# Altium schematic sheet Arduino MEGA 2560.SchDoc
size A; SheetNumber: 1; SheetTotal: 1
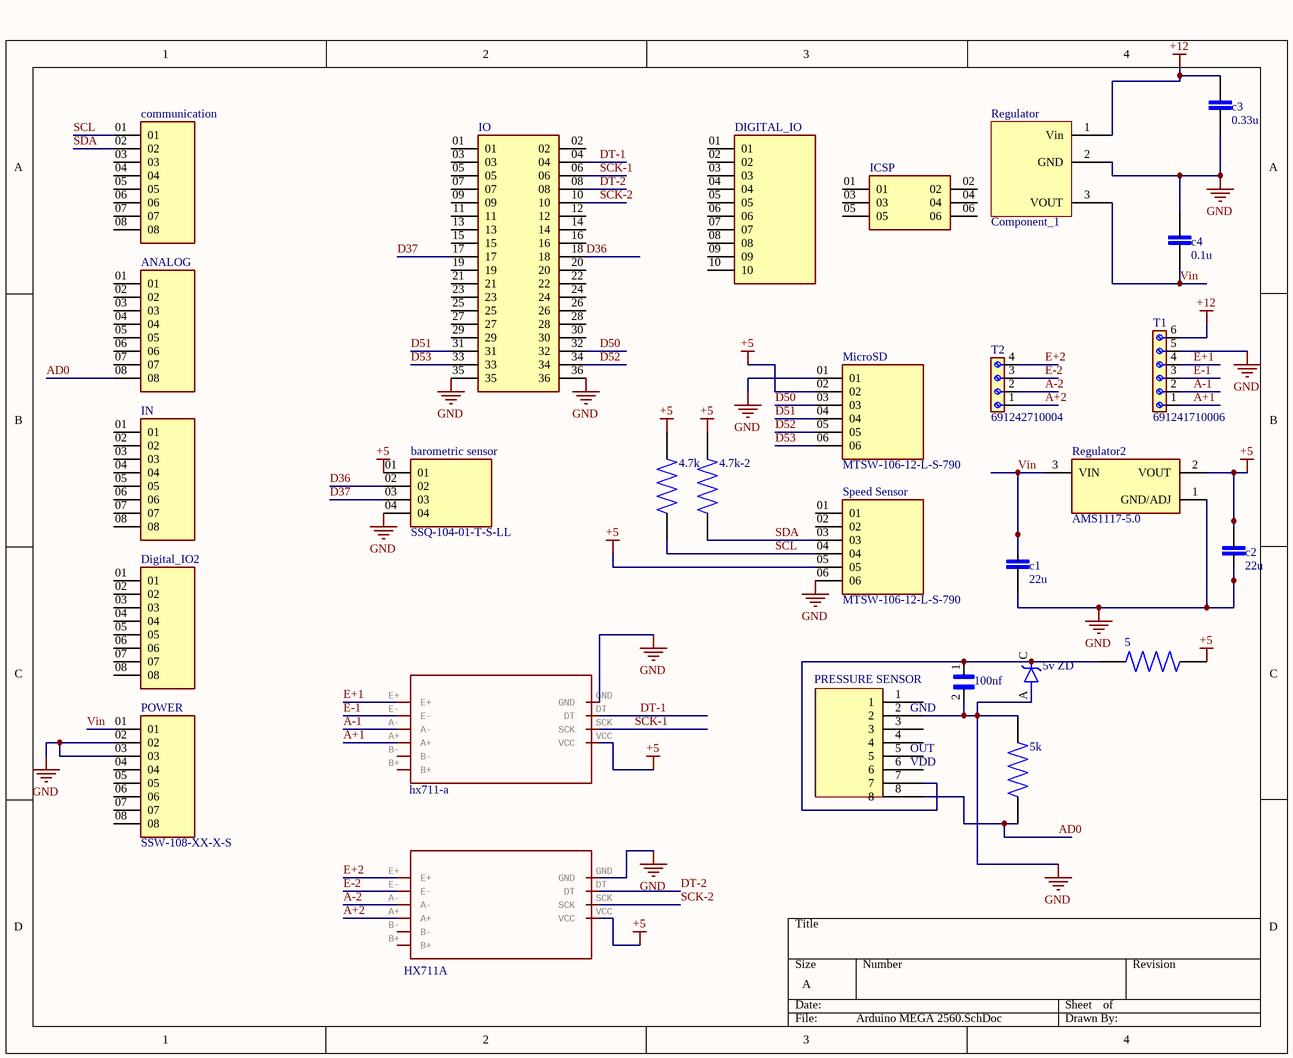
[diagram p0: Arduino MEGA 2560.SchDoc]

## Parts
4.7k  (no value)  [RESC2012X60N]
4.7k-2  (no value)  [RESC2012X60N]
5  (no value)  [RESC2012X60N]
5k  (no value)  [RESC2012X60N]
5v_ZD  1N4734A_T50R  [DIOAD1070W78L463D238P]  (value not drawn)
100nf  (no value)  [CAPC2012X140N]
ANALOG  (no value)  [SAMTEC_SSW-108-XX-X-S]
barometric_sensor  SSQ-104-01-T-S-LL  [SAMTEC_SSQ-104-01-T-S-LL]
c1  22u  [CAPC2012X140N]
c2  22u  [CAPC2012X140N]
c3  0.33u  [CAPC2012X140N]
c4  0.1u  [CAPC2012X140N]
communication  (no value)  [SAMTEC_SSW-108-XX-X-S]
DIGITAL_IO  (no value)  [SAMTEC_SSW-110-03-T-S]
Digital_IO2  (no value)  [SAMTEC_SSW-108-XX-X-S]
hx711-a  HX711A  [HX711]  (value not drawn)
hx711-b  HX711A  [HX711]
ICSP  (no value)  [SAMTEC_SSW-103-03-T-D]
IN  (no value)  [SAMTEC_SSW-108-XX-X-S]
IO  (no value)  [SAMTEC_SSW-118-03-T-D]
MicroSD  MTSW-106-12-L-S-790  [SAMTEC_MTSW-106-12-L-S-790]
POWER  SSW-108-XX-X-S  [SAMTEC_SSW-108-XX-X-S]
PRESSURE_SENSOR  (no value)  [SOP251P1810X750-8N]
Regulator  Component_1  [TO225P1040X460X1968-3]
Regulator2  AMS1117-5.0  [SOT229P700X180-4N]
Speed_Sensor  MTSW-106-12-L-S-790  [SAMTEC_MTSW-106-12-L-S-790]
T1  691241710006  [691241710006]
T2  691242710004  [691242710004]

## Nets
+5: 4.7k.2 4.7k-2.2 5.1 barometric_sensor.01 c2.2 hx711-a.VCC hx711-b.VCC MicroSD.02 Regulator2.2(VOUT) Speed_Sensor.05
+12: c3.2 Regulator.1(Vin) T1.6
GND: 5k.2 5v_ZD.A 100nf.2 barometric_sensor.04 c1.1 c2.1 c3.1 c4.2 hx711-a.GND hx711-b.GND IO.35 IO.36 MicroSD.01 POWER.02 POWER.03 PRESSURE_SENSOR.2 Regulator.2(GND) Regulator2.1(GND/ADJ) Speed_Sensor.06 T1.5
A+1: hx711-a.A+ T1.1
A+2: hx711-b.A+ T2.1
A-1: hx711-a.A- T1.2
A-2: hx711-b.A- T2.2
AD0: 5k.1 ANALOG.08 PRESSURE_SENSOR.8
D36: barometric_sensor.02 IO.18
D37: barometric_sensor.03 IO.17
D50: IO.32 MicroSD.03
D51: IO.31 MicroSD.04
D52: IO.34 MicroSD.05
D53: IO.33 MicroSD.06
DT-1: hx711-a.DT IO.04
DT-2: hx711-b.DT IO.08
E+1: hx711-a.E+ T1.4
E+2: hx711-b.E+ T2.4
E-1: hx711-a.E- T1.3
E-2: hx711-b.E- T2.3
SCK-1: hx711-a.SCK IO.06
SCK-2: hx711-b.SCK IO.10
SCL: 4.7k.1 communication.01 Speed_Sensor.04
SDA: 4.7k-2.1 communication.02 Speed_Sensor.03
Vin: c1.2 c4.1 POWER.01 Regulator.3(VOUT) Regulator2.3(VIN)
Net5_2: 5.2 5v_ZD.C 100nf.1 PRESSURE_SENSOR.7

Not connected (* = marked no-connect by the designer): ANALOG 01 02 03 04 05 06 07; communication 03 04 05 06 07 08; DIGITAL_IO 01 02 03 04 05 06 07 08 09 10; Digital_IO2 01 02 03 04 05 06 07 08; hx711-a B+ B-; hx711-b B+ B-; ICSP 01 02 03 04 05 06; IN 01 02 03 04 05 06 07 08; IO 01 02 03 05 07 09 11 12 13 14 15 16 19 20 21 22 23 24 25 26 27 28 29 30; POWER 04 05 06 07 08; PRESSURE_SENSOR 1 3 4 5 6; Speed_Sensor 01 02

## Notes on the sheet
- (in symbol PRESSURE SENSOR) GND; OUT; VDD

## Library data of the parts
4.7k 4.7k-2 5 5k = CR0805-FX-2001ELF: Res 0805 2k 1% 125mW | Bourns CR0805-FX-2001ELF; SnapEDA_Link: https://www.snapeda.com/parts/CR0805-FX-2001ELF/Bourns/view-part/?ref=snap; Package: 0805 Bourns; Value: *; MF: Bourns; MP: CR0805-FX-2001ELF; Check_prices: https://www.snapeda.com/parts/CR0805-FX-2001ELF/Bourns/view-part/?ref=eda
5v_ZD = 1N4734A_T50R: 1N4734 Series 1 W 5.6 V 10 uA Through Hole Zener Diode - DO-41; Package: None; Price: None; Value: *; MP: 1N4734A_T50R; Availability: Unavailable
100nf = LD052C153JAB2A: Ceramic Capacitor; MF: AVX; Package: 0805 AVX; MP: LD052C153JAB2A; SnapEDA_Link: https://www.snapeda.com/parts/LD052C153JAB2A/AVX/view-part/?ref=snap; Value: *; Availability: In Stock; Price: None; Check_prices: https://www.snapeda.com/parts/LD052C153JAB2A/AVX/view-part/?ref=eda
ANALOG communication Digital_IO2 IN POWER = SSW-108-XX-X-S: 8 Position Receptacle Connector Through Hole, Right Angle; MP: SSW-108-03-F-S; MF: Samtec; Availability: Bad; Purchase-URL: https://pricing.snapeda.com/search/part/SSW-108-03-F-S/?ref=eda; SnapEDA_Link: https://www.snapeda.com/parts/SSW-108-03-F-S/Samtec/view-part/3433832/?ref=snap; Price: None; Value: *; Check_prices: https://www.snapeda.com/parts/SSW-108-03-F-S/Samtec/view-part/3433832/?ref=eda; Package: None
barometric_sensor = SSQ-104-01-T-S-LL: 4 Position Receptacle Connector 0.100 (2.54mm) Through Hole Tin; MF: Samtec; SnapEDA_Link: https://www.snapeda.com/parts/SSQ-104-01-T-S-LL/Samtec/view-part/?ref=snap; Package: None; Value: *; MP: SSQ-104-01-T-S-LL; Check_prices: https://www.snapeda.com/parts/SSQ-104-01-T-S-LL/Samtec/view-part/?ref=eda
c1-c4 = LD051A121KAB2A: Ceramic Capacitor; MF: AVX; SnapEDA_Link: https://www.snapeda.com/parts/LD051A121KAB2A/AVX/view-part/?ref=snap; Package: 0805 AVX; MP: LD051A121KAB2A; Check_prices: https://www.snapeda.com/parts/LD051A121KAB2A/AVX/view-part/?ref=eda; Purchase-URL: https://pricing.snapeda.com/search/part/LD051A121KAB2A/?ref=eda; Price: None; Value: *; Availability: In Stock
DIGITAL_IO = SSW-110-03-T-S: MF: Samtec; Availability: Unavailable; Price: None; Package: None; Value: *; MP: SSW-110-03-T-S
hx711-a hx711-b = HX711A: GateName_1: G$1; DeviceName: A; SymbolName_1: HX711; LibraryName: HX711; DeviceSetName: HX711; Package: HX711
ICSP = SSW-103-03-T-D: SSW Series .100 Tiger Buyâ„¢ Socket Strip; MF: Samtec; Price: None; Check_prices: https://www.snapeda.com/parts/SSW-103-03-T-D/Samtec/view-part/?ref=eda; Package: None; SnapEDA_Link: https://www.snapeda.com/parts/SSW-103-03-T-D/Samtec/view-part/?ref=snap; Purchase-URL: https://pricing.snapeda.com/search/part/SSW-103-03-T-D/?ref=eda; Availability: In Stock; MP: SSW-103-03-T-D; Value: *
IO = SSW-118-03-T-D: 36 Position Receptacle Connector 0.100 (2.54mm) Through Hole, Right Angle Tin; MF: Samtec; SnapEDA_Link: https://www.snapeda.com/parts/SSW-118-03-T-D/Samtec/view-part/?ref=snap; Price: None; Check_prices: https://www.snapeda.com/parts/SSW-118-03-T-D/Samtec/view-part/?ref=eda; Purchase-URL: https://pricing.snapeda.com/search/part/SSW-118-03-T-D/?ref=eda; MP: SSW-118-03-T-D; Value: *; Availability: In Stock; Package: None
MicroSD Speed_Sensor = MTSW-106-12-L-S-790: HEADER, 6 CONTACTS, 1 ROW, THROUGH HOLE, 2.54 MM; Connector Systems:Board-to-Board; Pitch Spacing:2.54mm; No. of Rows:1Rows; No. of Contacts:6Contacts; Contact Termination Type:Through Hole; Product Range:MTSW Series; Gender:Header RoHS Compliant: Yes; MF: Samtec; MP: MTSW10612LS790; Value: *; Purchase-URL: https://pricing.snapeda.com/search/part/MTSW10612LS790/?ref=eda; Package: None; Availability: In Stock; SnapEDA_Link: https://www.snapeda.com/parts/MTSW10612LS790/Samtec/view-part/?ref=snap; Check_prices: https://www.snapeda.com/parts/MTSW10612LS790/Samtec/view-part/?ref=eda; Price: None
PRESSURE_SENSOR = PRESSURE SENSOR
Regulator2 = AMS1117-5.0: 1A LOW DROPOUT VOLTAGE REGULATOR; MF: ams; MP: AMS1117-5.0; Package: SOT-223 Seeed Technology; SnapEDA_Link: https://www.snapeda.com/parts/AMS1117-5.0/ams/view-part/?ref=snap; Check_prices: https://www.snapeda.com/parts/AMS1117-5.0/ams/view-part/?ref=eda; Availability: Not in stock; Value: *; Price: None
T1 = 691241710006: 6 Position Wire to Board Terminal Block Horizontal with Board 0.197 (5.00mm) Through Hole; MF: WÃ¼rth Elektronik; SnapEDA_Link: https://www.snapeda.com/parts/691241710006/Wurth+Elektronik/view-part/?ref=snap; Package: None; Value: *; MP: 691241710006; Check_prices: https://www.snapeda.com/parts/691241710006/Wurth+Elektronik/view-part/?ref=eda
T2 = 691242710004: 4 Position Wire to Board Terminal Block Horizontal with Board 0.197 (5.00mm) Through Hole; MF: Wurth Electronics; SnapEDA_Link: https://www.snapeda.com/parts/691242710004/Wurth+Elektronik/view-part/?ref=snap; Package: None; Value: *; MP: 691242710004; Check_prices: https://www.snapeda.com/parts/691242710004/Wurth+Elektronik/view-part/?ref=eda